# Altium project pca10095.PrjPCB (part 4 of 4)

## Sheet pca10095_sheet6_power_supply.SchDoc: PCA10095 - Power Supply
size A3; Organization: Nordic Semiconductor; DocumentNumber: 6; Revision: 0.8.0; SheetNumber: 6; SheetTotal: 6; Author: GETR; CompanyName: Nordic Semiconductor; DrawnBy: GETR; ProjectName: nRF53 Development Kit
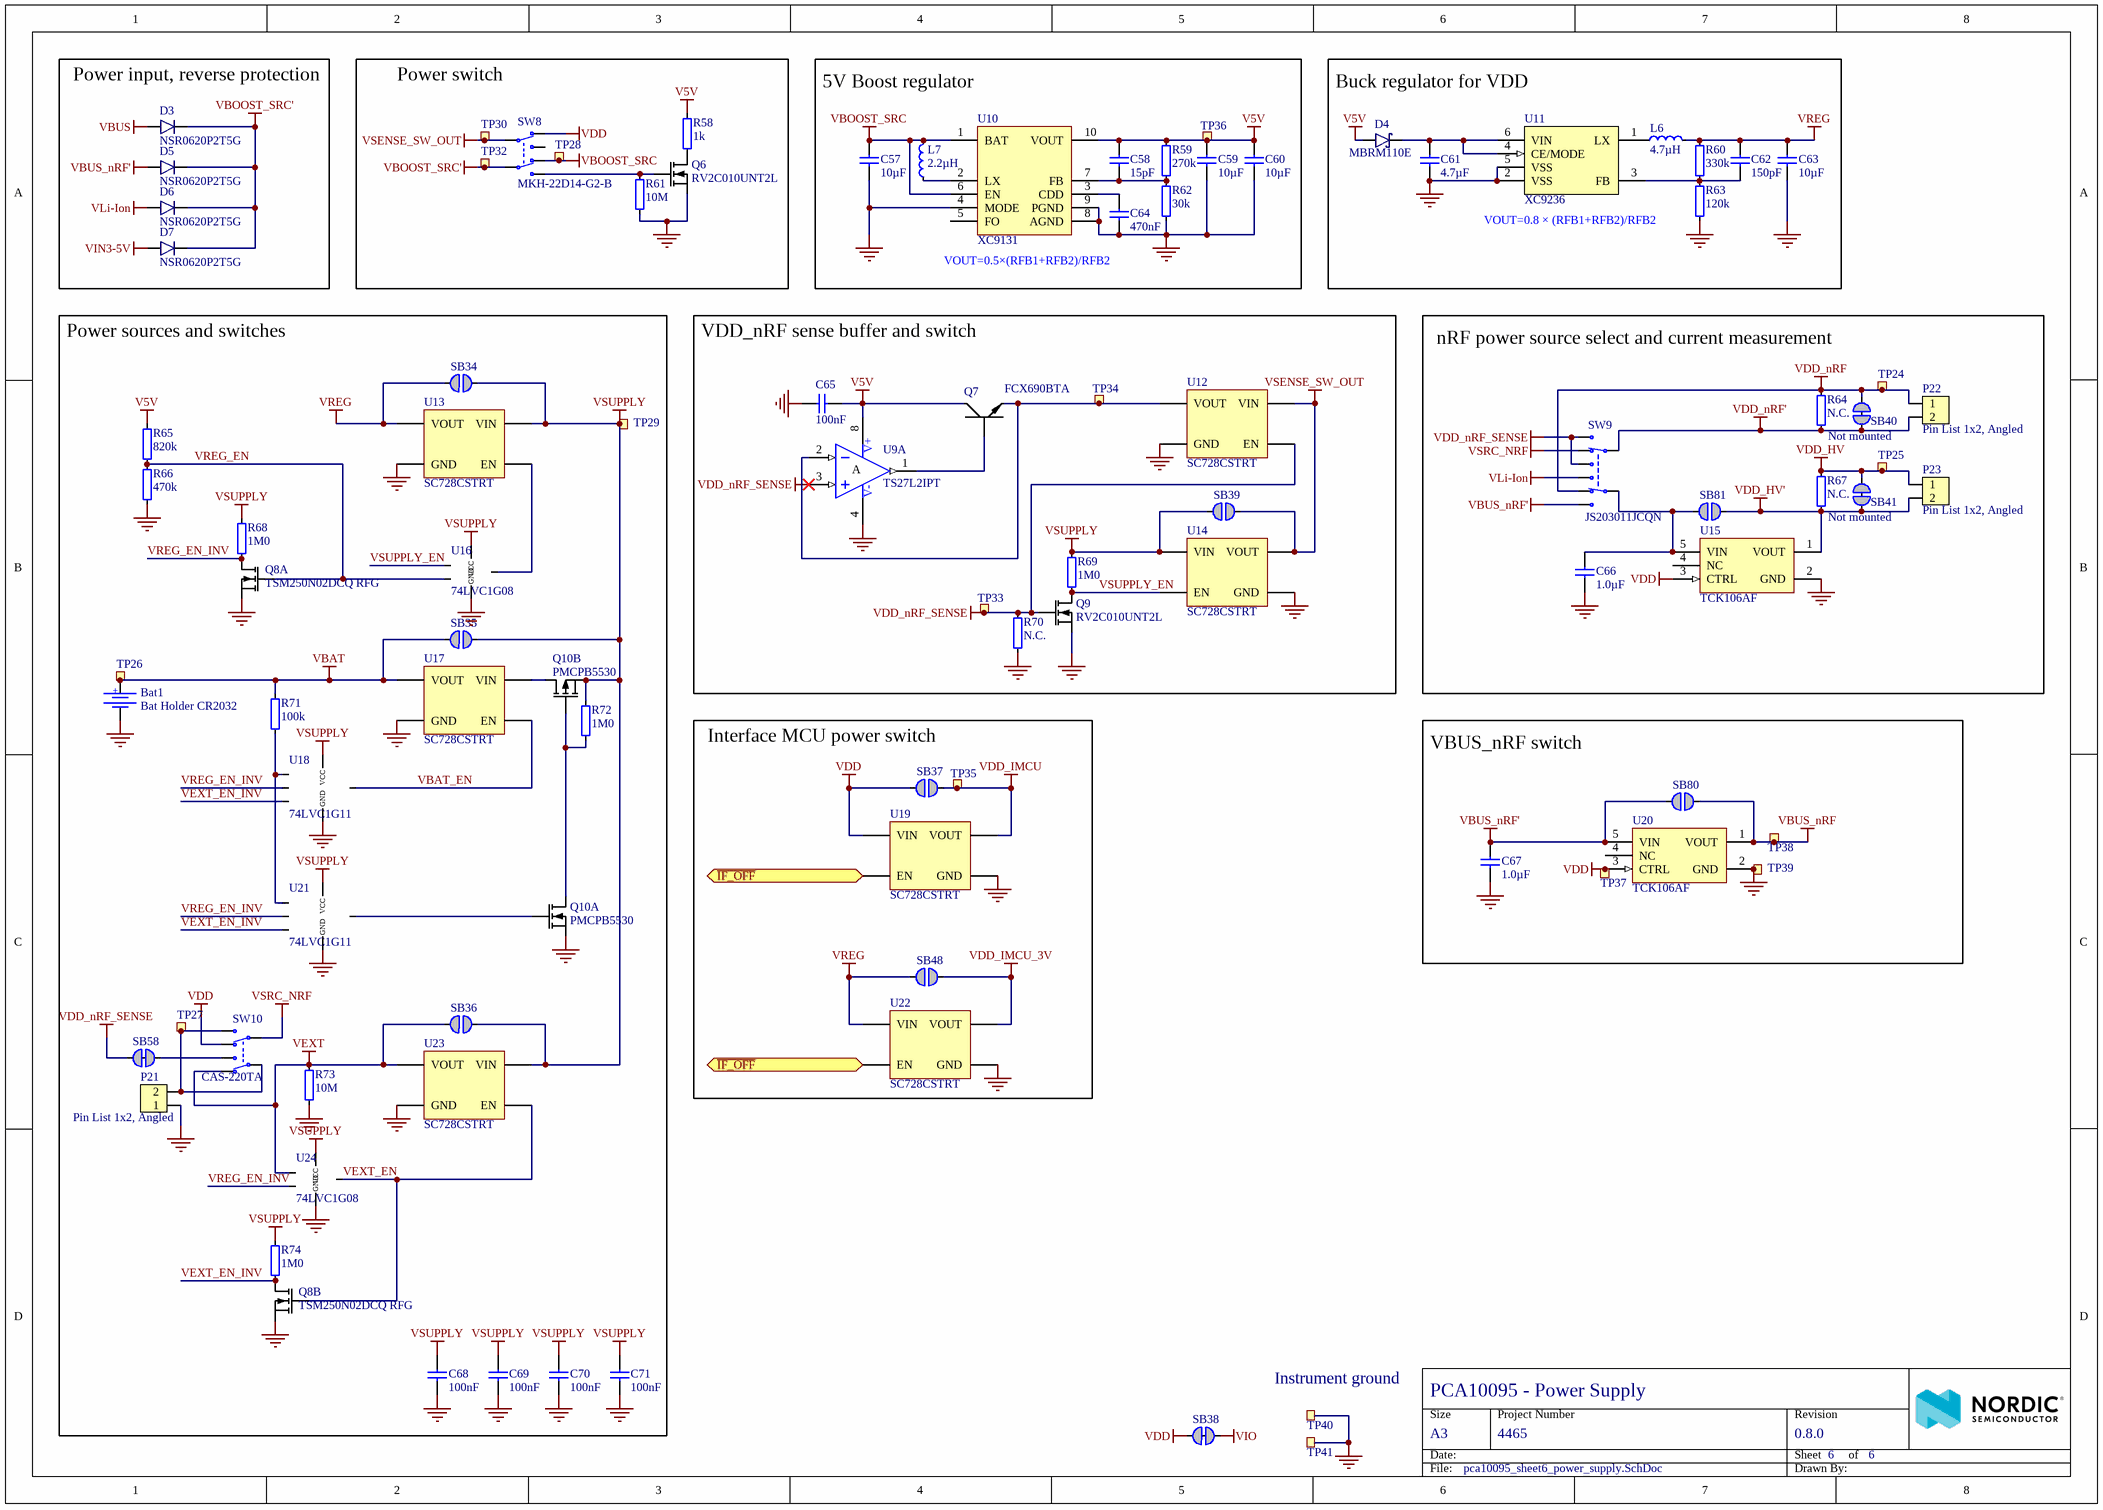
[diagram p5: pca10095_sheet6_power_supply.SchDoc]

### Parts
Bat1  Bat Holder CR2032  [L-KLS5-CR2032-23-B1]
C57  10µF  [CAPC1608X06L]
C58  15pF  [CAPC0603X03L_C]
C59  10µF  [CAPC1608X06L]
C60  10µF  [CAPC1608X06L]
C61  4.7µF  [CAPC1005X04L]
C62  150pF  [CAPC0603X03L_C]
C63  10µF  [CAPC1608X06L]
C64  470nF  [CAPC0603X03L_C]
C65  100nF  [CAPC0603X03L_C]
C66  1.0µF  [CAPC1005X04L]
C67  1.0µF  [CAPC1608X06L]
C68  100nF  [CAPC0603X03L_C]
C69  100nF  [CAPC0603X03L_C]
C70  100nF  [CAPC0603X03L_C]
C71  100nF  [CAPC0603X03L_C]
D3  NSR0620P2T5G  [SODFL100X40-2N]
D4  MBRM110E  [DO-216AA]
D5  NSR0620P2T5G  [SODFL100X40-2N]
D6  NSR0620P2T5G  [SODFL100X40-2N]
D7  NSR0620P2T5G  [SODFL100X40-2N]
L6  4.7µH  [TY-NR3015]
L7  2.2µH  [TY-NR3015]
P21  Pin List 1x2, Angled  [LIST_ANG_1x2-SMD-2.54MM]
P22  Pin List 1x2, Angled  [LIST_ANG_1x2-SMD-2.54MM]
P23  Pin List 1x2, Angled  [LIST_ANG_1x2-SMD-2.54MM]
Q6  RV2C010UNT2L  [DFN65P100X40-3L]
Q7  FCX690BTA  [SOT89-150P409X160-3N]
Q8  TSM250N02DCQ RFG  [DFN65P200X200X80_HS-6N]  (parts A,B of 2)
Q9  RV2C010UNT2L  [DFN65P100X40-3L]
Q10  PMCPB5530  [PMCPB5530X]  (parts A,B of 2)
R58  1k  [RESC0603X03L_C]
R59  270k  [RESC0603X03L_C]
R60  330k  [RESC0603X03L_C]
R61  10M  [RESC0603X03L_C]
R62  30k  [RESC0603X03L_C]
R63  120k  [RESC0603X03L_C]
R64  N.C.  Assembly: Not mounted  [RESC1005X04L]
R65  820k  [RESC0603X03L_C]
R66  470k  [RESC0603X03L_C]
R67  N.C.  Assembly: Not mounted  [RESC1005X04L]
R68  1M0  [RESC0603X03L_C]
R69  1M0  [RESC0603X03L_C]
R70  N.C.  [RESC0603X03L_C]
R71  100k  [RESC0603X03L_C]
R72  1M0  [RESC0603X03L_C]
R73  10M  [RESC0603X03L_C]
R74  1M0  [RESC0603X03L_C]
SB34  Solderbridge  [Solderbridge]  (value not drawn)  (no BOM)
SB35  Solderbridge  [Solderbridge]  (value not drawn)  (no BOM)
SB36  Solderbridge  [Solderbridge]  (value not drawn)  (no BOM)
SB37  Solderbridge  [Solderbridge]  (value not drawn)  (no BOM)
SB38  Solderbridge  [Solderbridge_Shorted]  (value not drawn)  (net tie, no BOM)
SB39  Solderbridge  [Solderbridge]  (value not drawn)  (no BOM)
SB40  Solderbridge  [Solderbridge_Shorted]  (value not drawn)  (net tie, no BOM)
SB41  Solderbridge  [Solderbridge_Shorted]  (value not drawn)  (net tie, no BOM)
SB48  Solderbridge  [Solderbridge]  (value not drawn)  (no BOM)
SB58  Solderbridge  [Solderbridge_Shorted]  (value not drawn)  (net tie, no BOM)
SB80  Solderbridge  [Solderbridge]  (value not drawn)  (no BOM)
SB81  Solderbridge  [Solderbridge]  (value not drawn)  (no BOM)
SW8  MKH-22D14-G2-B  [MKH-22D14-G2-B]
SW9  JS203011JCQN  [Switch-Slide-J-Lead-DP3T-13x3.5mm]
SW10  CAS-220TA  [CAS-220TA]
TP24  Ø1.5mm,SMD  [TP_SMD_Ø1.5mm]  (value not drawn)  (no BOM)
TP25  Ø1.5mm,SMD  [TP_SMD_Ø1.5mm]  (value not drawn)  (no BOM)
TP26  Ø1.5mm,SMD  [TP_SMD_Ø1.5mm]  (value not drawn)  (no BOM)
TP27  Ø1.5mm,SMD  [TP_SMD_Ø1.5mm]  (value not drawn)  (no BOM)
TP28  Ø1.5mm,SMD  [TP_SMD_Ø1.5mm]  (value not drawn)  (no BOM)
TP29  Ø1.0mm,SMD  [TP_SMD_Ø1.0mm]  (value not drawn)  (no BOM)
TP30  Ø1.5mm,SMD  [TP_SMD_Ø1.5mm]  (value not drawn)  (no BOM)
TP32  Ø1.5mm,SMD  [TP_SMD_Ø1.5mm]  (value not drawn)  (no BOM)
TP33  Ø1.0mm,SMD  [TP_SMD_Ø1.0mm]  (value not drawn)  (no BOM)
TP34  Ø1.0mm,SMD  [TP_SMD_Ø1.0mm]  (value not drawn)  (no BOM)
TP35  Ø1.0mm,SMD  [TP_SMD_Ø1.0mm]  (value not drawn)  (no BOM)
TP36  Ø1.0mm,SMD  [TP_SMD_Ø1.0mm]  (value not drawn)  (no BOM)
TP37  Ø1.5mm,SMD  [TP_SMD_Ø1.5mm]  (value not drawn)  (no BOM)
TP38  Ø1.5mm,SMD  [TP_SMD_Ø1.5mm]  (value not drawn)  (no BOM)
TP39  Ø1.5mm,SMD  [TP_SMD_Ø1.5mm]  (value not drawn)  (no BOM)
TP40  TP  [TESTPAD-TH]  (value not drawn)  (no BOM)
TP41  TP  [TESTPAD-TH]  (value not drawn)  (no BOM)
U9  TS27L2IPT  [TSOP65P640X120-8N]  (part A of 2)
U10  XC9131  [10-USPB (2.9x2.6)]
U11  XC9236  [USP-6C]
U12  SC728CSTRT  [BGA4C40P2X2_76X76X62]
U13  SC728CSTRT  [BGA4C40P2X2_76X76X62]
U14  SC728CSTRT  [BGA4C40P2X2_76X76X62]
U15  TCK106AF  [SOT95P280X140-5N]
U16  74LVC1G08  [SOT65P210X100-5N]
U17  SC728CSTRT  [BGA4C40P2X2_76X76X62]
U18  74LVC1G11  [SOT65P210X100-6N]
U19  SC728CSTRT  [BGA4C40P2X2_76X76X62]
U20  TCK106AF  [SOT95P280X140-5N]
U21  74LVC1G11  [SOT65P210X100-6N]
U22  SC728CSTRT  [BGA4C40P2X2_76X76X62]
U23  SC728CSTRT  [BGA4C40P2X2_76X76X62]
U24  74LVC1G08  [SOT65P210X100-5N]

### Blocks framed on the sheet
Power input, reverse protection: D3 D5-D7
Power switch: Q6 R58 R61 SW8 TP28 TP30 TP32
5V Boost regulator: C57-C60 C64 L7 R59 R62 TP36 U10
Buck regulator for VDD: C61-C63 D4 L6 R60 R63 U11
Power sources and switches: Bat1 C68-C71 P21 Q8 Q10 R65 R66 R68 R71-R74 SB34-SB36 SB58 SW10 TP26 TP27 TP29 U13 U16-U18 U21 U23 U24
VDD_nRF sense buffer and switch: C65 Q7 Q9 R69 R70 SB39 TP33 TP34 U9 U12 U14
nRF power source select and current measurement: C66 P22 P23 R64 R67 SB40 SB41 SB81 SW9 TP24 TP25 U15
Interface MCU power switch: SB37 SB48 TP35 U19 U22
VBUS_nRF switch: C67 SB80 TP37-TP39 U20

### Ports
~{IF_OFF} (bidir)

### Nets
GND: Bat1.2 C57.1 C59.1 C60.1 C61.1 C63.1 C64.1 C65.1 C66.1 C67.1 C68.1 C69.1 C70.1 C71.1 P21.1 Q6.2(S) Q8.1(S1) Q8.4(S2) Q9.2(S) Q10.1(S1) R61.2 R62.1 R63.1 R66.2 R70.2 R73.2 TP39.1 TP40.1 TP41.1 U9.4(V-) U10.4(MODE) U10.8(AGND) U10.9(PGND) U10.11(GND) U11.2(VSS) U11.5(VSS) U11.7(VSS) U12.B1(GND) U13.B1(GND) U14.B1(GND) U15.2(GND) U16.3(GND) U17.B1(GND) U18.2(GND) U19.B1(GND) U20.2(GND) U21.2(GND) U22.B1(GND) U23.B1(GND) U24.3(GND)
V5V: C58.2 C59.2 C60.2 C65.2 D4.1(A) Q7.2(C) R58.1 R59.2 R65.1 TP36.1 U9.8(V+) U10.10(VOUT)
VBAT: Bat1.1 R71.1 SB35.2 TP26.1 U17.A1(VOUT)
VBOOST_SRC: C57.2 L7.2 SW8.6(N.C-2) TP28.1 U10.1(BAT) U10.6(EN)
VBOOST_SRC': D3.1(C) D5.1(C) D6.1(C) D7.1(C) SW8.5(COM-2) TP32.1
VBUS: D3.2(A)
VBUS_nRF: SB80.1 TP38.1 U20.1(VOUT)
VBUS_nRF': C67.2 D5.2(A) SB80.2 SW9.8(N.O) U20.5(VIN)
VDD: SB37.2 SB38.2 SW8.3(N.C-1) SW10.6(N.C-2) TP37.1 U15.3(CTRL) U19.A2(VIN) U20.3(CTRL)
VDD_HV: P23.1 R67.2 SB41.1 TP25.1
VDD_HV': P23.2 R67.1 SB41.2 SB81.1 U15.1(VOUT)
VDD_IMCU: SB37.1 TP35.1 U19.A1(VOUT)
VDD_IMCU_3V: SB48.1 U22.A1(VOUT)
VDD_nRF: P22.1 R64.2 SB40.1 SW9.6(N.C) TP24.1
VDD_nRF': P22.2 R64.1 SB40.2 SW9.3(COM)
VDD_nRF_SENSE: Q9.1(G) R70.1 SB58.1 SW9.1(N.O) SW9.4(N.O) TP33.1 U9.3(IN1+) U12.B2(EN)
VEXT: R73.1 SB36.2 SW10.3(N.C-1) U23.A1(VOUT) U24.1(A)
VIN3-5V: D7.2(A)
VIO: SB38.1
VLi-Ion: D6.2(A) SW9.5(N.O)
VREG: C62.2 C63.2 L6.2 R60.2 SB34.2 SB48.2 U13.A1(VOUT) U22.A2(VIN)
VSENSE_SW_OUT: SB39.1 SW8.2(COM-1) TP30.1 U12.A2(VIN) U14.A1(VOUT)
VSRC_NRF: SW9.2(N.C) SW10.5(COM-2)
VSUPPLY: C68.2 C69.2 C70.2 C71.2 Q10.4(S2) R68.1 R69.1 R72.1 R74.1 SB34.1 SB35.1 SB36.1 SB39.2 TP29.1 U13.A2(VIN) U14.A2(VIN) U16.5(VCC) U18.5(VCC) U21.5(VCC) U23.A2(VIN) U24.5(VCC)
~{IF_OFF}: U19.B2(EN) U22.B2(EN) ; port ~{IF_OFF}
VBAT_EN: U17.B2(EN) U18.4(Y)
VEXT_EN: Q8.5(G2) U23.B2(EN) U24.4(Y)
VEXT_EN_INV: Q8.3(D2) R74.2 U18.6(C) U21.6(C)
VREG_EN: Q8.2(G1) R65.2 R66.1 U16.2(B)
VREG_EN_INV: Q8.6(D1) R68.2 U18.3(B) U21.3(B) U24.2(B)
VSUPPLY_EN: Q9.3(D) R69.2 U14.B2(EN) U16.1(A)
NetC58_1: C58.1 R59.1 R62.2 U10.7(FB)
NetC61_2: C61.2 D4.3(C) U11.4(CE/MODE) U11.6(VIN)
NetC62_1: C62.1 R60.1 R63.2 U11.3(FB)
NetC64_2: C64.2 U10.3(CDD)
NetC66_2: C66.2 SB81.2 SW9.7(COM) U15.5(VIN)
NetL6_1: L6.1 U11.1(LX)
NetL7_1: L7.1 U10.2(LX)
NetP21_2: P21.2 SW10.2(COM-1) SW10.4(N.O-2) TP27.1
NetQ6_1: Q6.1(G) R61.1 SW8.4(N.O-2)
NetQ6_3: Q6.3(D) R58.2
NetQ7_1: Q7.1(B) U9.1(OUT1)
NetQ7_3: Q7.3(E) TP34.1 U9.2(IN1-) U12.A1(VOUT)
NetQ10_2: Q10.2(G1) U21.4(Y)
NetQ10_3: Q10.3(D2) U17.A2(VIN)
NetQ10_5: Q10.5(G2) Q10.6(D1) R72.2
NetR71_2: R71.2 U18.1(A) U21.1(A)
NetSB58_2: SB58.2 SW10.1(N.O-1)
NetU13_B2: U13.B2(EN) U16.4(Y)

Not connected (* = marked no-connect by the designer): SW8 1(N.O-1); U10 5(FO); U15 4(NC); U20 4(NC)

### Notes on the sheet
- VOUT=0.8 × (RFB1+RFB2)/RFB2
- VOUT=0.5×(RFB1+RFB2)/RFB2
- (near TP40) Instrument ground
- Size
- Date:
- A3
- Project Number
- Sheet         of
- Revision
- File:
- Drawn By:
- (in symbol Bat Holder Cabcon L-KLS5-CR2032-23-B1) +
- (in symbol TS27L2IPT, part A) A

### Library data of the parts
Bat1 = Bat Holder Cabcon L-KLS5-CR2032-23-B1: Bat Holder CR2032 SMD; Manufacturer: Cabcon; Artikkelnr Noca: N.A.; Part Number: Bat Holder Cabcon L-KLS5-CR2032-23-B1; Manufacturer Part Number: L-KLS5-CR2032-23-B1; ComponentLink1URL: *; ComponentLink1Description: Datasheet; ComponentLink2URL: *; ComponentLink2Description: Supplier link; HelpURL: *; Footprint Doc: CR2032_HOLDER; LatestRevisionDate: 2019-08-28; Pin Count: 2; Publisher: Nordic Semiconductor; Published: 2019-08-28; Value: Bat Holder CR2032; Note: Bat Holder CR2032; Supplier 1: Cabcon; Supplier Part Number 1: L-KLS5-CR2032-23-B1; Supplier 2: Mouser; Supplier Part Number 2: 614-SMTU2032-LF; Part number IPS: N.A.
C57 C59 C60 C63 = C0603-10µF-25V: Capacitor, 0603, 25V, X5R; Part number IPS: N.A.; Artikkelnr Noca: 20039436; Part Number: C0603-10µF-25V; Manufacturer: *; Manufacturer Part Number: *; Footprint Doc: 0603; LatestRevisionDate: 2015-02-25; Pin Count: 2; Publisher: Nordic Semiconductor; Published: 2015-02-25; Value: 10µF; Note: 25V; ComponentLink1URL: *; ComponentLink1Description: Datasheet; ComponentLink2URL: *; ComponentLink2Description: Supplier link; HelpURL: *; Supplier 1: *; Supplier Part Number 1: *; Supplier 2: *; Supplier Part Number 2: *
C58 = C0201-15p: Chip Cap 0201; Note: Chip Cap 1%; Artikkelnr Noca: N.A.; Part Number: C0201-15p; Manufacturer: *; Manufacturer Part Number: *; Footprint Doc: 0201; LatestRevisionDate: 2014-11-13; Pin Count: 2; Publisher: Nordic Semiconductor; Published: 2014-11-13; Value: 15pF; Part number IPS: N.A.; ComponentLink1URL: *; ComponentLink1Description: Datasheet; ComponentLink2URL: *; ComponentLink2Description: Supplier link; HelpURL: *; Supplier 1: *; Supplier Part Number 1: *; Supplier 2: *; Supplier Part Number 2: *
C61 = C0402-4µ7-10V-X5R: CAP CER 4.7UF 10V X5R 0402; Manufacturer: Murata; Manufacturer Part Number: GRM155R61A475MEAAD; Artikkelnr Noca: N.A.; Part Number: C0402-4µ7-10V-X5R; ComponentLink1URL: http://search.murata.co.jp/Ceramy/image/img/A01X/G101/ENG/GRM155R61A475MEAA-01.pdf; ComponentLink1Description: Datasheet; ComponentLink2URL: https://www.digikey.com/product-detail/en/murata-electronics-north-america/GRM155R61A475MEAAD/490-14306-1-ND/6234742; ComponentLink2Description: Supplier link - Digikey; HelpURL: https://psearch.en.murata.com/capacitor/product/GRM155R61A475MEAA%23.html; Footprint Doc: 0402; LatestRevisionDate: 2018-10-04; Pin Count: 2; Publisher: Nordic Semiconductor; Published: 2018-10-04; Value: 4.7µF; Note: 10V; Supplier 1: Digi-Key; Supplier Part Number 1: 490-14306-1-ND; Supplier 2: *; Supplier Part Number 2: *; Part number IPS: N.A.
C62 = C0201-150p: Chip Cap 0201; Note: Chip Cap 1%; Artikkelnr Noca: N.A.; Part Number: C0201-150p; Manufacturer: *; Manufacturer Part Number: *; Footprint Doc: 0201; LatestRevisionDate: 2014-11-13; Pin Count: 2; Publisher: Nordic Semiconductor; Published: 2014-11-13; Value: 150pF; Part number IPS: N.A.; ComponentLink1URL: *; ComponentLink1Description: Datasheet; ComponentLink2URL: *; ComponentLink2Description: Supplier link; HelpURL: *; Supplier 1: *; Supplier Part Number 1: *; Supplier 2: *; Supplier Part Number 2: *
C64 = C0201-470n: Chip Cap 0201; Note: Chip Cap 1%; Artikkelnr Noca: N.A.; Part Number: C0201-470n; Manufacturer: *; Manufacturer Part Number: *; Footprint Doc: 0201; LatestRevisionDate: 2014-11-13; Pin Count: 2; Publisher: Nordic Semiconductor; Published: 2014-11-13; Value: 470nF; Part number IPS: N.A.; ComponentLink1URL: *; ComponentLink1Description: Datasheet; ComponentLink2URL: *; ComponentLink2Description: Supplier link; HelpURL: *; Supplier 1: *; Supplier Part Number 1: *; Supplier 2: *; Supplier Part Number 2: *
C65 C68-C71 = C0201-100n: Capacitor, X5R, ±10%; Part number IPS: 00000001248; Note: 16V; Artikkelnr Noca: N.A.; Part Number: C0201-100n; Manufacturer: *; Manufacturer Part Number: *; Footprint Doc: 0201; LatestRevisionDate: 2017-11-09; Pin Count: 2; Publisher: Nordic Semiconductor; Published: 2014-11-13; Value: 100nF; ComponentLink1URL: *; ComponentLink1Description: Datasheet; ComponentLink2URL: *; ComponentLink2Description: Supplier link; HelpURL: *; Supplier 1: *; Supplier Part Number 1: *; Supplier 2: *; Supplier Part Number 2: *
C66 = C0402-1µ0: Capacitor, X5R, ±5%; Part number IPS: 00000007786; Note: 6.3V; Artikkelnr Noca: 20039235; Part Number: C0402-1µ0; Manufacturer: *; Manufacturer Part Number: *; LatestRevisionDate: 2016-08-22; Pin Count: 2; Publisher: Nordic Semiconductor; Published: 2009-05-08; Value: 1.0µF; Footprint Doc: 0402; ComponentLink1URL: *; ComponentLink1Description: Datasheet; ComponentLink2URL: *; ComponentLink2Description: Supplier link; HelpURL: *; Supplier 1: Digi-Key; Supplier Part Number 1: 1276-1444-1-ND; Supplier 2: *; Supplier Part Number 2: *
C67 = C0603-1µ0: Capacitor, X7R, ±10%; Part number IPS: 00000000616; Note: 16V; Artikkelnr Noca: 20039282; Part Number: C0603-1µ0; Manufacturer: *; Manufacturer Part Number: *; Footprint Doc: 0603; LatestRevisionDate: 2013-06-05; Pin Count: 2; Publisher: Nordic Semiconductor; Published: 2009-05-08; Value: 1.0µF; ComponentLink1URL: *; ComponentLink1Description: Datasheet; ComponentLink2URL: *; ComponentLink2Description: Supplier link; HelpURL: *; Supplier 1: *; Supplier Part Number 1: *; Supplier 2: *; Supplier Part Number 2: *
D3 D5-D7 = NSR0620P2T5G: 20V schottky barrier diode, Vf 350 mV @ 100 mA, Ir 2.0 µA @ 10 V, If 500 mA; Manufacturer: ON Semiconductor; Part number IPS: 00000009952; Artikkelnr Noca: 10029169; Part Number: NSR0620P2T5G; Manufacturer Part Number: NSR0620P2T5G; LatestRevisionDate: 2016-07-07; Publisher: Nordic Semiconductor; Published: 2016-07-07; Value: NSR0620P2T5G; Note: *; Footprint Doc: SOD-923; ComponentLink1URL: *; ComponentLink1Description: Datasheet; ComponentLink2URL: *; ComponentLink2Description: Supplier link; HelpURL: http://www.onsemi.com/pub_link/Collateral/NSR0620P2-D.PDF; Pin Count: 2; Supplier 1: Digi-Key; Supplier Part Number 1: NSR0620P2T5GOSCT-ND; Supplier 2: *; Supplier Part Number 2: *
D4 = MBRM110E: Diode Schottky Vf=0.455V @ 100mA, Vr=10V, If=1000mA, Ir=1µA @ 10V; Manufacturer: ON Semiconductor; Manufacturer Part Number: MBRM110ET1G; Part number IPS: N.A.; Artikkelnr Noca: 10029172; Part Number: MBRM110E; Footprint Doc: DO-216AA; LatestRevisionDate: 2016-10-24; Publisher: Nordic Semiconductor; Published: 2016-10-24; Value: MBRM110E; Note: *; ComponentLink1URL: *; ComponentLink1Description: Datasheet; ComponentLink2URL: *; ComponentLink2Description: Supplier link; HelpURL: http://media.digikey.com/pdf/Data%20Sheets/ON%20Semiconductor%20PDFs/MBRM110E-D.pdf; Pin Count: 2; Supplier 1: Digi-Key; Supplier Part Number 1: MBRM110ET1GOSTR-ND; Supplier 2: Farnell; Supplier Part Number 2: 236-9429
L6 = NR3015-4µ7-1.04A-144mOhm: Ferrite Inductor, Shielded, 1,04A, 144mOhm; Manufacturer: Taiyo Yuden; Manufacturer Part Number: NR3015T4R7M; Part number IPS: 00000009960; Artikkelnr Noca: 33029551; Part Number: NR3015-4µ7-1.04A-144mOhm; Footprint Doc: 1212; LatestRevisionDate: 2014-01-22; Pin Count: 2; Publisher: Nordic Semiconductor; Published: 2014-01-22; Value: 4.7µH; Note: *; ComponentLink1Description: Datasheet; ComponentLink2Description: Supplier link; ComponentLink1URL: *; ComponentLink2URL: *; HelpURL: http://www.yuden.co.jp/ut/product/category/inductor/NR3015T4R7M.pdf; Supplier 1: Digi-Key; Supplier Part Number 1: 587-1649-1-ND; Supplier 2: Mouser; Supplier Part Number 2: 963-NR3015T4R7M
L7 = NR3015-2µ2-1.5A-72mOhm: Ferrite Inductor, Shielded, 1,5A, 72mOhm; Manufacturer: Taiyo Yuden; Manufacturer Part Number: NR3015T2R2M; Part number IPS: N.A.; Artikkelnr Noca: 33029487; Part Number: NR3015-2µ2-1.5A-72mOhm; Footprint Doc: 1212; LatestRevisionDate: 2014-01-22; Pin Count: 2; Publisher: Nordic Semiconductor; Published: 2014-01-22; Value: 2.2µH; Note: *; ComponentLink1Description: Datasheet; ComponentLink2Description: Supplier link; ComponentLink1URL: *; ComponentLink2URL: *; HelpURL: http://www.yuden.co.jp/ut/product/category/inductor/NR3015T2R2M.pdf; Supplier 1: Digi-Key; Supplier Part Number 1: 587-1648-1-ND; Supplier 2: Farnell; Supplier Part Number 2: 188-5853
P21-P23 = Pin List Ang 1x2 SMD, 2.54mm: Pin List 1x2, 2.54mm (100mil), Right Angled, SMD; Manufacturer: W-CON; Manufacturer Part Number: 1125B-1102S0Z135R2; Part number IPS: 00000009972; Artikkelnr Noca: 55010023; Part Number: Pin List Ang 1x2 SMD, 2.54mm; Footprint Doc: LIST_ANG_1x2-SMD-2.54MM; LatestRevisionDate: 2016-05-26; Pin Count: 2; Publisher: Nordic Semiconductor; Published: 2016-01-22; Value: Pin List 1x2, Angled; Note: *; ComponentLink1URL: *; ComponentLink1Description: Datasheet; ComponentLink2URL: *; ComponentLink2Description: Supplier link; HelpURL: \\hizz\pro\app9717\Datasheet\connectores\W-CON\1125B-11XXXXZXXXXX.pdf; Supplier 1: Cabcon; Supplier Part Number 1: 1125B-1102S0Z135R2; Supplier 2: Samtec; Supplier Part Number 2: TSM-102-01-L-SH-A
Q6 Q9 = RV2C010UNT2L: N-Channel MOSFET, 20V, 1A, 470mOhm, 400mW; Manufacturer: Rohm Semiconductor; Part number IPS: 00000009976; Artikkelnr Noca: 35010020; Part Number: RV2C010UNT2L; Manufacturer Part Number: RV2C010UNT2L; Footprint Doc: DFN-3; LatestRevisionDate: 2016-08-09; Publisher: Nordic Semiconductor; Published: 2016-08-09; Value: RV2C010UNT2L; Note: *; ComponentLink1URL: *; ComponentLink1Description: Datasheet; ComponentLink2URL: *; ComponentLink2Description: Supplier link; HelpURL: http://rohmfs.rohm.com/en/products/databook/datasheet/discrete/transistor/mosfet/rv2c010unt2l-e.pdf; Pin Count: 3; Supplier 1: Digi-Key; Supplier Part Number 1: RV2C010UNT2LCT-ND; Supplier 2: Mouser; Supplier Part Number 2: 755-RV2C010UNT2L
Q7 = FCX690BTA: 45V NPN high gain power transistor; Manufacturer: Diodes Incorporated; Part number IPS: 00000009974; Artikkelnr Noca: 35010019; Part Number: FCX690BTA; Manufacturer Part Number: FCX690BTA; Footprint Doc: SOT-89; LatestRevisionDate: 2016-07-07; Publisher: Nordic Semiconductor; Published: 2016-07-07; Value: FCX690BTA; Note: *; ComponentLink1URL: *; ComponentLink1Description: Datasheet; ComponentLink2URL: *; ComponentLink2Description: Supplier link; HelpURL: http://www.diodes.com/_files/datasheets/FCX690B.pdf; Pin Count: 3; Supplier 1: Digi-Key; Supplier Part Number 1: FCX690BCT-ND; Supplier 2: *; Supplier Part Number 2: *
Q8 = TSM250N02DCQ RFG: Dual N Ch MOFET, 5.8A, 55mOhm max, 620mW; Manufacturer: Taiwan Semiconductor; Part number IPS: 00000001703; Artikkelnr Noca: N.A.; Part Number: TSM250N02DCQ RFG; Manufacturer Part Number: TSM250N02DCQ RFG; LatestRevisionDate: 2018-10-31; Pin Count: 6; Publisher: Nordic Semiconductor; Published: 2018-10-31; Value: TSM250N02DCQ RFG; Note: *; Footprint Doc: VDFN-6; ComponentLink1URL: https://www.taiwansemi.com/products/datasheet/TSM250N02D_B15.pdf; ComponentLink1Description: Datasheet; ComponentLink2URL: *; ComponentLink2Description: Supplier link; HelpURL: https://www.taiwansemi.com/products/datasheet/TSM250N02D_B15.pdf; Supplier 1: Digi-Key; Supplier Part Number 1: TSM250N02DCQRFGCT-ND; Supplier 2: *; Supplier Part Number 2: *
Q10 = PMCPB5530X,115: Mosfet Array N and P-Channel 20V 4A (Ta), 3.4A (Ta) 490mW Surface Mount 6-HUSON-EP (2x2); Manufacturer: Nexperia; Artikkelnr Noca: N.A.; Part Number: PMCPB5530X,115; Manufacturer Part Number: PMCPB5530X,115; ComponentLink1URL: https://assets.nexperia.com/documents/data-sheet/PMCPB5530X.pdf; ComponentLink1Description: Datasheet; ComponentLink2URL: https://www.digikey.com/product-detail/en/nexperia-usa-inc/PMCPB5530X115/1727-1327-1-ND/4386339; ComponentLink2Description: Supplier link; HelpURL: https://www.nexperia.com/products/mosfets/small-signal-mosfets/PMCPB5530X.html; Footprint Doc: 6-UDFN; LatestRevisionDate: 2018-04-30; Pin Count: 8; Publisher: Nordic Semiconductor; Published: 2018-04-30; Value: PMCPB5530; Note: *; Supplier 1: Digi-Key; Supplier Part Number 1: 1727-1327-1-ND; Supplier 2: Mouser; Supplier Part Number 2: 771-PMCPB5530X115; Part number IPS: N.A.
R58 = R0201-1k0: Resistor, ±1%, 0.05W; Part number IPS: 00000005786; Note: Chip Res 1%; Artikkelnr Noca: N.A.; Part Number: R0201-1k0; Manufacturer: *; Manufacturer Part Number: *; LatestRevisionDate: 2014-11-13; Pin Count: 2; Publisher: Nordic Semiconductor; Published: 2014-11-13; Value: 1k; Footprint Doc: 0201; ComponentLink1URL: *; ComponentLink1Description: Datasheet; ComponentLink2URL: *; ComponentLink2Description: Supplier link; HelpURL: *; Supplier 1: *; Supplier Part Number 1: *; Supplier 2: *; Supplier Part Number 2: *
R59 = R0201-270k: Resistor, ±1%, 0.05W; Note: Chip Res 1%; Artikkelnr Noca: N.A.; Part Number: R0201-270k; Manufacturer: *; Manufacturer Part Number: *; Footprint Doc: 0201; LatestRevisionDate: 2014-11-13; Pin Count: 2; Publisher: Nordic Semiconductor; Published: 2014-11-13; Value: 270k; Part number IPS: N.A.; ComponentLink1URL: *; ComponentLink1Description: Datasheet; ComponentLink2URL: *; ComponentLink2Description: Supplier link; HelpURL: *; Supplier 1: *; Supplier Part Number 1: *; Supplier 2: *; Supplier Part Number 2: *
R60 = R0201-330k: Resistor, ±1%, 0.05W; Part number IPS: 00000001424; Note: Chip Res 1%; Artikkelnr Noca: N.A.; Part Number: R0201-330k; Manufacturer: *; Manufacturer Part Number: *; Footprint Doc: 0201; LatestRevisionDate: 2014-11-13; Pin Count: 2; Publisher: Nordic Semiconductor; Published: 2014-11-13; Value: 330k; ComponentLink1URL: *; ComponentLink1Description: Datasheet; ComponentLink2URL: *; ComponentLink2Description: Supplier link; HelpURL: *; Supplier 1: *; Supplier Part Number 1: *; Supplier 2: *; Supplier Part Number 2: *
R61 R73 = R0201-10M: Resistor, ±1%, 0.05W; Part number IPS: 00000001426; Note: Chip Res 1%; Artikkelnr Noca: N.A.; Part Number: R0201-10M; Manufacturer: *; Manufacturer Part Number: *; LatestRevisionDate: 2014-11-13; Pin Count: 2; Publisher: Nordic Semiconductor; Published: 2014-11-13; Value: 10M; Footprint Doc: 0201; ComponentLink1URL: *; ComponentLink1Description: Datasheet; ComponentLink2URL: *; ComponentLink2Description: Supplier link; HelpURL: *; Supplier 1: *; Supplier Part Number 1: *; Supplier 2: *; Supplier Part Number 2: *
R62 = R0201-30k: Resistor, ±1%, 0.05W; Note: Chip Res 1%; Artikkelnr Noca: N.A.; Part Number: R0201-30k; Manufacturer: *; Manufacturer Part Number: *; Footprint Doc: 0201; LatestRevisionDate: 2016-04-20; Pin Count: 2; Publisher: Nordic Semiconductor; Published: 2016-04-20; Value: 30k; Part number IPS: N.A.; ComponentLink1URL: *; ComponentLink1Description: Datasheet; ComponentLink2URL: *; ComponentLink2Description: Supplier link; HelpURL: *; Supplier 1: *; Supplier Part Number 1: *; Supplier 2: *; Supplier Part Number 2: *
R63 = R0201-120k: Resistor, ±1%, 0.05W; Part number IPS: 00000001425; Note: Chip Res 1%; Artikkelnr Noca: N.A.; Part Number: R0201-120k; Manufacturer: *; Manufacturer Part Number: *; Footprint Doc: 0201; LatestRevisionDate: 2014-11-13; Pin Count: 2; Publisher: Nordic Semiconductor; Published: 2014-11-13; Value: 120k; ComponentLink1URL: *; ComponentLink1Description: Datasheet; ComponentLink2URL: *; ComponentLink2Description: Supplier link; HelpURL: *; Supplier 1: *; Supplier Part Number 1: *; Supplier 2: *; Supplier Part Number 2: *
R64 R67 = R0402-N.C.: Not mounted; Note: Chip Res; Artikkelnr Noca: N.A.; Part Number: R0402-N.C.; Manufacturer: *; Manufacturer Part Number: *; LatestRevisionDate: 2009-05-08; Pin Count: 2; Publisher: Nordic Semiconductor; Published: 2009-05-08; Value: N.C.; Footprint Doc: 0402; Part number IPS: N.A.; ComponentLink1URL: *; ComponentLink1Description: Datasheet; ComponentLink2URL: *; ComponentLink2Description: Supplier link; HelpURL: *; Supplier 1: *; Supplier Part Number 1: *; Supplier 2: *; Supplier Part Number 2: *
R65 = R0201-820k: Resistor, ±1%, 0.05W; Part number IPS: 00000001427; Note: Chip Res 1%; Artikkelnr Noca: N.A.; Part Number: R0201-820k; Manufacturer: *; Manufacturer Part Number: *; LatestRevisionDate: 2014-11-13; Pin Count: 2; Publisher: Nordic Semiconductor; Published: 2014-11-13; Value: 820k; Footprint Doc: 0201; ComponentLink1URL: *; ComponentLink1Description: Datasheet; ComponentLink2URL: *; ComponentLink2Description: Supplier link; HelpURL: *; Supplier 1: *; Supplier Part Number 1: *; Supplier 2: *; Supplier Part Number 2: *
R66 = R0201-470k: Resistor, ±1%, 0.05W; Part number IPS: 00000001428; Note: Chip Res 1%; Artikkelnr Noca: N.A.; Part Number: R0201-470k; Manufacturer: *; Manufacturer Part Number: *; LatestRevisionDate: 2014-11-13; Pin Count: 2; Publisher: Nordic Semiconductor; Published: 2014-11-13; Value: 470k; Footprint Doc: 0201; ComponentLink1URL: *; ComponentLink1Description: Datasheet; ComponentLink2URL: *; ComponentLink2Description: Supplier link; HelpURL: *; Supplier 1: *; Supplier Part Number 1: *; Supplier 2: *; Supplier Part Number 2: *
R68 R69 R72 R74 = R0201-1M0: Resistor, ±1%, 0.05W; Part number IPS: 00000001418; Note: Chip Res 1%; Artikkelnr Noca: N.A.; Part Number: R0201-1M0; Manufacturer: *; Manufacturer Part Number: *; LatestRevisionDate: 2014-11-13; Pin Count: 2; Publisher: Nordic Semiconductor; Published: 2014-11-13; Value: 1M0; Footprint Doc: 0201; ComponentLink1URL: *; ComponentLink1Description: Datasheet; ComponentLink2URL: *; ComponentLink2Description: Supplier link; HelpURL: *; Supplier 1: *; Supplier Part Number 1: *; Supplier 2: *; Supplier Part Number 2: *
R70 = R0201-N.C.: Not mounted; Note: Chip Res; Artikkelnr Noca: N.A.; Assembly: Not mounted; Part Number: R0201-N.C.; Manufacturer: *; Manufacturer Part Number: *; LatestRevisionDate: 2014-11-13; Pin Count: 2; Publisher: Nordic Semiconductor; Published: 2014-11-13; Value: N.C.; Footprint Doc: 0201; Part number IPS: N.A.; ComponentLink1URL: *; ComponentLink1Description: Datasheet; ComponentLink2URL: *; ComponentLink2Description: Supplier link; HelpURL: *; Supplier 1: *; Supplier Part Number 1: *; Supplier 2: *; Supplier Part Number 2: *
R71 = R0201-100k: Resistor, ±1%, 0.05W; Part number IPS: 00000001419; Note: Chip Res 1%; Artikkelnr Noca: N.A.; Part Number: R0201-100k; Manufacturer: *; Manufacturer Part Number: *; LatestRevisionDate: 2014-11-13; Pin Count: 2; Publisher: Nordic Semiconductor; Published: 2014-11-13; Value: 100k; Footprint Doc: 0201; ComponentLink1URL: *; ComponentLink1Description: Datasheet; ComponentLink2URL: *; ComponentLink2Description: Supplier link; HelpURL: *; Supplier 1: *; Supplier Part Number 1: *; Supplier 2: *; Supplier Part Number 2: *
SB34-SB37 SB39 SB48 SB80 SB81 = Solderbridge: Artikkelnr Noca: N.A.; Part Number: Solderbridge; Manufacturer: *; Manufacturer Part Number: *; LatestRevisionDate: 2009-12-14; Pin Count: 2; Publisher: Nordic Semiconductor; Published: 2009-12-14; Value: Solderbridge; Note: *; Footprint Doc: Solderbridge; Part number IPS: N.A.; ComponentLink1URL: *; ComponentLink1Description: Datasheet; ComponentLink2URL: *; ComponentLink2Description: Supplier link; HelpURL: *; Supplier 1: *; Supplier Part Number 1: *; Supplier 2: *; Supplier Part Number 2: *
SB38 SB40 SB41 SB58 = Solderbridge Shorted: Shorted Solderbridge; Artikkelnr Noca: N.A.; Part Number: Solderbridge Shorted; Manufacturer: *; Manufacturer Part Number: *; LatestRevisionDate: 2012-08-07; Pin Count: 2; Publisher: Nordic Semiconductor; Published: 2012-08-07; Value: Solderbridge; Note: *; Footprint Doc: Solderbridge_Shorted; Part number IPS: N.A.; ComponentLink1URL: *; ComponentLink1Description: Datasheet; ComponentLink2URL: *; ComponentLink2Description: Supplier link; HelpURL: *; Supplier 1: *; Supplier Part Number 1: *; Supplier 2: *; Supplier Part Number 2: *
SW8 = MKH-22D14-G2-B: Slide Switch DPDT; Manufacturer: Dailywell; Part number IPS: N.A.; Artikkelnr Noca: 50019112; Part Number: MKH-22D14-G2-B; Manufacturer Part Number: MKH-22D14-G2-B; Footprint Doc: MKH-22D14-G2-B; LatestRevisionDate: 2016-08-18; Pin Count: 6; Publisher: Nordic Semiconductor; Published: 2016-08-18; Value: MKH-22D14-G2-B; Note: *; ComponentLink1URL: *; ComponentLink1Description: Datasheet; ComponentLink2URL: *; ComponentLink2Description: Supplier link; HelpURL: \\hizz\pro\app9717\Datasheet\switches\Dailywell\MKH-22D14-G2-B.pdf; Supplier 1: *; Supplier Part Number 1: *; Supplier 2: *; Supplier Part Number 2: *
SW9 = JS203011JCQN: Slide Switch DP3T 300mA 6V; Manufacturer: C&K Components; Part number IPS: N.A.; Artikkelnr Noca: 50019116; Part Number: JS203011JCQN; Manufacturer Part Number: JS203011JCQN; Footprint Doc: Switch-Slide-J-Lead-DP3T-13x3.5mm; LatestRevisionDate: 2016-10-05; Pin Count: 8; Publisher: Nordic Semiconductor; Published: 2016-10-05; Value: JS203011JCQN; Note: *; ComponentLink1URL: *; ComponentLink1Description: Datasheet; ComponentLink2URL: *; ComponentLink2Description: Supplier link; HelpURL: http://www.ckswitches.com/media/1422/js.pdf; Supplier 1: Digi-Key; Supplier Part Number 1: CKN10725CT-ND; Supplier 2: *; Supplier Part Number 2: *
SW10 = CAS-220TA: Slide Switch DPDT J Hook; Manufacturer: Copal Electronics Inc; Part number IPS: 00000009983; Artikkelnr Noca: 50019042; Part Number: CAS-220TA; Manufacturer Part Number: CAS-220TA; Footprint Doc: CAS-220TA; LatestRevisionDate: 2010-02-18; Pin Count: 6; Publisher: Nordic Semiconductor; Published: 2010-02-18; Value: CAS-220TA; Note: *; ComponentLink1URL: *; ComponentLink1Description: Datasheet; ComponentLink2URL: *; ComponentLink2Description: Supplier link; HelpURL: http://media.digikey.com/pdf/Data%20Sheets/COPAL%20Electronics%20PDFs/CAS%20SMD%20Slide%20Switch.pdf; Supplier 1: Digi-Key; Supplier Part Number 1: CAS220JTR-ND; Supplier 2: *; Supplier Part Number 2: *
TP24-TP28 TP30 TP32 TP37-TP39 = TP_SMD_Ø1.5MM: 1.0mm circular SMD testpad; Manufacturer: Nordic Semiconductor; Artikkelnr Noca: N.A.; Part Number: TP_SMD_Ø1.5MM; Manufacturer Part Number: *; LatestRevisionDate: 2016-06-02; Pin Count: 1; Publisher: Nordic Semiconductor; Published: 2016-06-02; Value: Ø1.5mm,SMD; Note: *; Footprint Doc: TP_SMD_Ø1.5mm; Part number IPS: N.A.; ComponentLink1URL: *; ComponentLink1Description: Datasheet; ComponentLink2URL: *; ComponentLink2Description: Supplier link; HelpURL: *; Supplier 1: *; Supplier Part Number 1: *; Supplier 2: *; Supplier Part Number 2: *
TP29 TP33-TP36 = TP_SMD_Ø1.0MM: 1.0mm circular SMD testpad; Manufacturer: Nordic Semiconductor; Artikkelnr Noca: N.A.; Part Number: TP_SMD_Ø1.0MM; Manufacturer Part Number: *; LatestRevisionDate: 2013-06-11; Pin Count: 1; Publisher: Nordic Semiconductor; Published: 2013-06-11; Value: Ø1.0mm,SMD; Note: *; Footprint Doc: TP_SMD_Ø1.0mm; Part number IPS: N.A.; ComponentLink1URL: *; ComponentLink1Description: Datasheet; ComponentLink2URL: *; ComponentLink2Description: Supplier link; HelpURL: *; Supplier 1: *; Supplier Part Number 1: *; Supplier 2: *; Supplier Part Number 2: *
TP40 TP41 = Testpoint TH: Testpoint, through hole; Artikkelnr Noca: N.A.; Part Number: Testpoint TH; Manufacturer: *; Manufacturer Part Number: *; Footprint Doc: TESTPAD-TH; LatestRevisionDate: 2009-12-12; Pin Count: 1; Publisher: Nordic Semiconductor; Published: 2009-12-12; Value: TP; Note: *; Part number IPS: N.A.; ComponentLink1URL: *; ComponentLink1Description: Datasheet; ComponentLink2URL: *; ComponentLink2Description: Supplier link; HelpURL: *; Supplier 1: *; Supplier Part Number 1: *; Supplier 2: *; Supplier Part Number 2: *
U9 = TS27L2IPT: Precision very low power CMOS dual operational amplifier; Manufacturer: STMicroelectronics; Part number IPS: 00000009991; Artikkelnr Noca: 17010019; Part Number: TS27L2IPT; Manufacturer Part Number: TS27L2IPT; Footprint Doc: TSSOP-8; LatestRevisionDate: 2016-07-07; Pin Count: 8; Publisher: Nordic Semiconductor; Published: 2016-07-07; Value: TS27L2IPT; Note: *; ComponentLink1URL: *; ComponentLink1Description: Datasheet; ComponentLink2URL: *; ComponentLink2Description: Supplier link; HelpURL: http://www.st.com/content/ccc/resource/technical/document/datasheet/38/5b/ca/bd/c0/26/4a/34/CD00000880.pdf/files/CD00000880.pdf/jcr:content/translations/en.CD00000880.pdf; Supplier 1: Digi-Key; Supplier Part Number 1: 497-8085-1-ND; Supplier 2: *; Supplier Part Number 2: *
U10 = XC9131H05CDR-G: 1A Driver Transistor Built-In, Multi Functional Step-Up DC/DC Converter; Manufacturer: Torex Semiconductor; Part number IPS: N.A.; Artikkelnr Noca: 17030086; Part Number: XC9131H05CDR-G; Manufacturer Part Number: XC9131H05CDR-G; Footprint Doc: UFDFN-10; LatestRevisionDate: 2016-08-08; Pin Count: 10; Publisher: Nordic Semiconductor; Published: 2016-08-08; Value: XC9131; Note: *; ComponentLink1URL: *; ComponentLink1Description: Datasheet; ComponentLink2URL: *; ComponentLink2Description: Supplier link; HelpURL: http://www.torexsemi.com/products/dcdc_converters/data/XC9131.pdf; Supplier 1: Digi-Key; Supplier Part Number 1: XC9131H05CDR-G-ND; Supplier 2: *; Supplier Part Number 2: *
U11 = XC9236D08CER-G: 600mA Driver Transistor Built-In, Synchronous Step-Down DC/DC Converters; Manufacturer: Torex Semiconductor; Part number IPS: N.A.; Artikkelnr Noca: 17030085; Part Number: XC9236D08CER-G; Manufacturer Part Number: XC9236D08CER-G; Footprint Doc: USP-6C; LatestRevisionDate: 2017-11-15; Pin Count: 6; Publisher: Nordic Semiconductor; Published: 2017-11-15; Value: XC9236; Note: *; ComponentLink1URL: *; ComponentLink1Description: Datasheet; ComponentLink2URL: *; ComponentLink2Description: Supplier link; HelpURL: http://www.torexsemi.com/products/dcdc_converters/data/XC9235~37.pdf; Supplier 1: Mouser; Supplier Part Number 1: 865-XC9236D08CER-G; Supplier 2: Digi-Key; Supplier Part Number 2: XC9236D08CER-G-ND
U12-U14 U17 U19 U22 U23 = SC728CSTRT: Semtech, 2A Low Vin, Very Low Ron, Load Switch, 4DSBGA; Manufacturer: Semtech Corporation; Part number IPS: N.A.; Artikkelnr Noca: 15070081; Part Number: SC728CSTRT; Manufacturer Part Number: SC728CSTRT; Footprint Doc: WCSP-4; LatestRevisionDate: 2015-01-01; Pin Count: 4; Publisher: Nordic Semiconductor; Published: 2016-06-16; Value: SC728CSTRT; Note: *; ComponentLink1URL: *; ComponentLink1Description: Datasheet; ComponentLink2URL: *; ComponentLink2Description: Supplier link; HelpURL: http://www.semtech.com/images/datasheet/sc728.pdf; Supplier 1: Digi-Key; Supplier Part Number 1: SC728CSTRTCT-ND; Supplier 2: Mouser; Supplier Part Number 2: 947-SC728CSTRT
U15 U20 = TCK106AF,LF: 1.0 A Load Switch IC with Slew Rate Control Driver in Small Package; Manufacturer: Toshiba; Part number IPS: 00000007823; Artikkelnr Noca: 15070086; Part Number: TCK106AF,LF; Manufacturer Part Number: TCK106AF,LF; Footprint Doc: SOT-25; LatestRevisionDate: 2016-09-29; Pin Count: 5; Publisher: Nordic Semiconductor; Published: 2016-09-29; Value: TCK106AF; Note: *; ComponentLink1URL: *; ComponentLink1Description: Datasheet; ComponentLink2URL: *; ComponentLink2Description: Supplier link; HelpURL: https://toshiba.semicon-storage.com/info/docget.jsp?did=53240&prodName=TCK108AF; Supplier 1: Digi-Key; Supplier Part Number 1: TCK106AFLFCT-ND; Supplier 2: *; Supplier Part Number 2: *
U16 U24 = 74LVC1G08GW: Single 2-Input AND Gate; Manufacturer: NXP Semiconductors; Part number IPS: 00000009992; Artikkelnr Noca: 15049058; Part Number: 74LVC1G08GW; Manufacturer Part Number: 74LVC1G08GW; Footprint Doc: SC70-5; LatestRevisionDate: 2016-10-18; Pin Count: 5; Publisher: Nordic Semiconductor; Published: 2016-10-18; Value: 74LVC1G08; Note: Single 2-Input AND Gate; ComponentLink1URL: *; ComponentLink1Description: Datasheet; ComponentLink2URL: *; ComponentLink2Description: Supplier link; HelpURL: http://www.nxp.com/documents/data_sheet/74LVC1G08.pdf; Supplier 1: Digi-Key; Supplier Part Number 1: 568-1580-1-ND; Supplier 2: Farnell; Supplier Part Number 2: 242-8299
U18 U21 = 74LVC1G11GW: Single 3-input AND gate; Manufacturer: NXP Semiconductors; Part number IPS: 00000001430; Artikkelnr Noca: 15079348; Part Number: 74LVC1G11GW; Manufacturer Part Number: 74LVC1G11GW; Footprint Doc: SC70-6; LatestRevisionDate: 2016-10-18; Pin Count: 6; Publisher: Nordic Semiconductor; Published: 2016-10-18; Value: 74LVC1G11; Note: Single 3-input AND gate; ComponentLink1URL: *; ComponentLink1Description: Datasheet; ComponentLink2URL: *; ComponentLink2Description: Supplier link; HelpURL: http://www.nxp.com/documents/data_sheet/74LVC1G11.pdf; Supplier 1: Digi-Key; Supplier Part Number 1: 568-7757-1-ND; Supplier 2: Farnell; Supplier Part Number 2: 243-8826

## Nets that join several sheets
GND: pca10095_sheet2_nrf5340_mcu (40 pins), pca10095_sheet3_interface_mcu (36 pins), pca10095_sheet4_misc (22 pins), pca10095_sheet5_connectors (84 pins), pca10095_sheet6_power_supply (50 pins)
V5V: pca10095_sheet5_connectors (5 pins), pca10095_sheet6_power_supply (12 pins)
VBUS: pca10095_sheet2_nrf5340_mcu (R1.1), pca10095_sheet4_misc (Q5.2 R52.1), pca10095_sheet5_connectors (C50.2 FB2.2), pca10095_sheet6_power_supply (D3.2)
VBUS_nRF': pca10095_sheet5_connectors (C48.2 FB1.2), pca10095_sheet6_power_supply (5 pins)
VDD: pca10095_sheet4_misc (16 pins), pca10095_sheet5_connectors (R57.2 SB47.1 SB59.2), pca10095_sheet6_power_supply (8 pins)
VDD_HV: pca10095_sheet2_nrf5340_mcu (C26.1 U1.E1), pca10095_sheet5_connectors (P20.10 P26.10), pca10095_sheet6_power_supply (P23.1 R67.2 SB41.1 TP25.1)
VDD_HV': pca10095_sheet5_connectors (P20.11 P26.11), pca10095_sheet6_power_supply (5 pins)
VDD_IMCU: pca10095_sheet3_interface_mcu (31 pins), pca10095_sheet6_power_supply (SB37.1 TP35.1 U19.A1)
VDD_IMCU_3V: pca10095_sheet3_interface_mcu (R11.2 SB19.2), pca10095_sheet6_power_supply (SB48.1 U22.A1)
VDD_nRF: pca10095_sheet2_nrf5340_mcu (33 pins), pca10095_sheet4_misc (SB18.1), pca10095_sheet5_connectors (P20.1 P26.1), pca10095_sheet6_power_supply (5 pins)
VDD_nRF': pca10095_sheet5_connectors (P20.2 P26.2 SB60.2), pca10095_sheet6_power_supply (P22.2 R64.1 SB40.2 SW9.3)
VIN3-5V: pca10095_sheet5_connectors (P20.9 P26.9), pca10095_sheet6_power_supply (D7.2)
VIO: pca10095_sheet5_connectors (9 pins), pca10095_sheet6_power_supply (SB38.1)
VLi-Ion: pca10095_sheet5_connectors (J6.2 P27.2 TP31.1), pca10095_sheet6_power_supply (D6.2 SW9.5)
D_N: pca10095_sheet2_nrf5340_mcu (U1.B4), pca10095_sheet5_connectors (R53.1)
D_P: pca10095_sheet2_nrf5340_mcu (U1.B2), pca10095_sheet5_connectors (R54.1)
DHSD_N: pca10095_sheet3_interface_mcu (R16.1), pca10095_sheet5_connectors (D2.2 J2.2 TP10.1)
DHSD_P: pca10095_sheet3_interface_mcu (R15.1), pca10095_sheet5_connectors (D2.3 J2.3 TP9.1)
EXT_VTG: pca10095_sheet3_interface_mcu (Q2.4 R8.1), pca10095_sheet5_connectors (P19.1 SB47.2)
~{IF_OFF}: pca10095_sheet3_interface_mcu (Q1.2 Q2.2), pca10095_sheet4_misc (6 pins), pca10095_sheet6_power_supply (U19.B2 U22.B2)
IMCU_BOOT: pca10095_sheet3_interface_mcu (U2.53), pca10095_sheet4_misc (SB46.2 U6.15)
MX25_~{CS}: pca10095_sheet2_nrf5340_mcu (SB13.2), pca10095_sheet4_misc (U7.1)
MX25_SCLK: pca10095_sheet2_nrf5340_mcu (SB11.2), pca10095_sheet4_misc (U7.6)
MX25_SIO0: pca10095_sheet2_nrf5340_mcu (SB12.2), pca10095_sheet4_misc (U7.5)
MX25_SIO1: pca10095_sheet2_nrf5340_mcu (SB14.2), pca10095_sheet4_misc (U7.2)
MX25_SIO2: pca10095_sheet2_nrf5340_mcu (SB15.2), pca10095_sheet4_misc (U7.3)
MX25_SIO3: pca10095_sheet2_nrf5340_mcu (SB10.2), pca10095_sheet4_misc (U7.7)
NetP1_3: pca10095_sheet4_misc (SB43.2 SB44.1 U6.4), pca10095_sheet5_connectors (5 pins)
NetP6_3: pca10095_sheet2_nrf5340_mcu (R42.1), pca10095_sheet5_connectors (P6.3 P12.3 P17.6)
NetP6_4: pca10095_sheet2_nrf5340_mcu (R45.1), pca10095_sheet5_connectors (P6.4 P12.4 P17.8)
NetP24_3: pca10095_sheet2_nrf5340_mcu (SB22.2), pca10095_sheet5_connectors (P24.3)
NetP24_4: pca10095_sheet2_nrf5340_mcu (SB24.2), pca10095_sheet5_connectors (P24.4)
NetP24_5: pca10095_sheet2_nrf5340_mcu (SB25.2), pca10095_sheet5_connectors (P24.5)
NetP24_6: pca10095_sheet2_nrf5340_mcu (SB20.2), pca10095_sheet5_connectors (P24.6)
NetP24_7: pca10095_sheet2_nrf5340_mcu (SB21.2), pca10095_sheet5_connectors (P24.7)
NetP24_8: pca10095_sheet2_nrf5340_mcu (SB23.2), pca10095_sheet5_connectors (P24.8)
NetR57_1: pca10095_sheet4_misc (U6.10), pca10095_sheet5_connectors (R57.1 SB33.2 TP19.1)
NFC1: pca10095_sheet4_misc (C43.1 R43.1), pca10095_sheet5_connectors (J5.2 TP17.1)
NFC2: pca10095_sheet4_misc (C44.2 R46.1), pca10095_sheet5_connectors (J5.4 TP18.1)
P0.00: pca10095_sheet2_nrf5340_mcu (SB3.2), pca10095_sheet5_connectors (P6.1 P12.1 P17.2)
P0.01: pca10095_sheet2_nrf5340_mcu (SB4.2), pca10095_sheet5_connectors (P6.2 P12.2 P17.4)
P0.02/NFC1: pca10095_sheet2_nrf5340_mcu (R42.2 U1.W1), pca10095_sheet4_misc (R43.2)
P0.03/NFC2: pca10095_sheet2_nrf5340_mcu (R45.2 U1.AA1), pca10095_sheet4_misc (R46.2)
P0.04/AIN0: pca10095_sheet2_nrf5340_mcu (U1.V2), pca10095_sheet5_connectors (P2.1 P8.1 P14.2 TP42.1)
P0.05/AIN1: pca10095_sheet2_nrf5340_mcu (U1.Y2), pca10095_sheet5_connectors (P2.2 P8.2 P14.4 TP43.1)
P0.06/AIN2: pca10095_sheet2_nrf5340_mcu (U1.AB2), pca10095_sheet5_connectors (P2.3 P8.3 P14.6 TP44.1)
P0.07/AIN3: pca10095_sheet2_nrf5340_mcu (U1.AD2), pca10095_sheet5_connectors (7 pins)
P0.08/TRACEDATA3: pca10095_sheet2_nrf5340_mcu (U1.AH2), pca10095_sheet4_misc (SW3.2), pca10095_sheet5_connectors (P6.6 P12.6 P17.12 P25.20)
P0.09/TRACEDATA2: pca10095_sheet2_nrf5340_mcu (U1.AJ1), pca10095_sheet4_misc (SW4.2), pca10095_sheet5_connectors (P6.7 P12.7 P17.14 P25.18)
P0.10/TRACEDATA1: pca10095_sheet2_nrf5340_mcu (U1.AK2), pca10095_sheet5_connectors (P6.8 P12.8 P17.16 P25.16)
P0.11/TRACEDATA0: pca10095_sheet2_nrf5340_mcu (U1.AK4), pca10095_sheet4_misc (SB57.1), pca10095_sheet5_connectors (P18.6 P24.1 P25.6 P25.14)
P0.12/TRACECLK: pca10095_sheet2_nrf5340_mcu (U1.AK6), pca10095_sheet5_connectors (P24.2 P25.12)
P0.19: pca10095_sheet2_nrf5340_mcu (U1.AL13), pca10095_sheet4_misc (SB51.1), pca10095_sheet5_connectors (P24.9)
P0.20: pca10095_sheet2_nrf5340_mcu (U1.AK16), pca10095_sheet4_misc (SB53.1), pca10095_sheet5_connectors (P24.10)
P0.21: pca10095_sheet2_nrf5340_mcu (U1.AL15), pca10095_sheet4_misc (SB50.1), pca10095_sheet5_connectors (P24.11)
P0.22: pca10095_sheet2_nrf5340_mcu (U1.AK18), pca10095_sheet4_misc (SB52.1), pca10095_sheet5_connectors (P24.12)
P0.23: pca10095_sheet2_nrf5340_mcu (U1.AK20), pca10095_sheet4_misc (SW1.2), pca10095_sheet5_connectors (P24.13)
P0.24: pca10095_sheet2_nrf5340_mcu (U1.AL27), pca10095_sheet4_misc (SW2.2), pca10095_sheet5_connectors (P24.14)
P0.25/AIN4: pca10095_sheet2_nrf5340_mcu (U1.AK28), pca10095_sheet5_connectors (P2.5 P8.5 P14.10 TP46.1)
P0.26/AIN5: pca10095_sheet2_nrf5340_mcu (U1.AL29), pca10095_sheet5_connectors (P2.6 P8.6 P14.12 TP47.1)
P0.27/AIN6: pca10095_sheet2_nrf5340_mcu (U1.AK30), pca10095_sheet5_connectors (P4.8 P10.8 P16.16)
P0.28/AIN7: pca10095_sheet2_nrf5340_mcu (U1.AE31), pca10095_sheet4_misc (SB5.1), pca10095_sheet5_connectors (P24.15)
P0.29: pca10095_sheet2_nrf5340_mcu (U1.U31), pca10095_sheet4_misc (SB6.1), pca10095_sheet5_connectors (P24.16)
P0.30: pca10095_sheet2_nrf5340_mcu (U1.B24), pca10095_sheet4_misc (SB7.1), pca10095_sheet5_connectors (P24.17)
P0.31: pca10095_sheet2_nrf5340_mcu (U1.B22), pca10095_sheet4_misc (SB8.1), pca10095_sheet5_connectors (P24.18)
P1.00: pca10095_sheet2_nrf5340_mcu (U1.M2), pca10095_sheet5_connectors (P3.1 P9.1 P15.2)
P1.01: pca10095_sheet2_nrf5340_mcu (U1.P2), pca10095_sheet5_connectors (P3.2 P9.2 P15.4)
P1.02: pca10095_sheet2_nrf5340_mcu (R20.1), pca10095_sheet4_misc (U6.8), pca10095_sheet5_connectors (P4.9 P10.9 P16.18)
P1.03: pca10095_sheet2_nrf5340_mcu (R24.1), pca10095_sheet4_misc (U6.12), pca10095_sheet5_connectors (P4.10 P10.10 P16.20)
P1.04: pca10095_sheet2_nrf5340_mcu (U1.AL19), pca10095_sheet5_connectors (P3.3 P9.3 P15.6)
P1.05: pca10095_sheet2_nrf5340_mcu (U1.AK22), pca10095_sheet5_connectors (P3.4 P9.4 P15.8)
P1.06: pca10095_sheet2_nrf5340_mcu (U1.AL21), pca10095_sheet5_connectors (P3.5 P9.5 P15.10)
P1.07: pca10095_sheet2_nrf5340_mcu (U1.AK24), pca10095_sheet5_connectors (P3.6 P9.6 P15.12)
P1.08: pca10095_sheet2_nrf5340_mcu (U1.AL23), pca10095_sheet5_connectors (P3.7 P9.7 P15.14)
P1.09: pca10095_sheet2_nrf5340_mcu (U1.AK26), pca10095_sheet5_connectors (P3.8 P9.8 P15.16)
P1.10: pca10095_sheet2_nrf5340_mcu (U1.R31), pca10095_sheet5_connectors (P4.1 P10.1 P16.2)
P1.11: pca10095_sheet2_nrf5340_mcu (U1.B20), pca10095_sheet5_connectors (P4.2 P10.2 P16.4)
P1.12: pca10095_sheet2_nrf5340_mcu (U1.B18), pca10095_sheet5_connectors (P4.3 P10.3 P16.6)
P1.13: pca10095_sheet2_nrf5340_mcu (U1.A17), pca10095_sheet5_connectors (5 pins)
P1.14: pca10095_sheet2_nrf5340_mcu (U1.B16), pca10095_sheet5_connectors (5 pins)
P1.15: pca10095_sheet2_nrf5340_mcu (U1.B14), pca10095_sheet5_connectors (5 pins)
~{RESET}: pca10095_sheet2_nrf5340_mcu (U1.AC31), pca10095_sheet4_misc (SB42.2 SB44.2 SB45.2 SB56.1), pca10095_sheet5_connectors (P18.10 P25.10)
SH_VTG: pca10095_sheet3_interface_mcu (Q1.4 R26.1), pca10095_sheet5_connectors (P20.3 P26.3)
SWD0_RESET: pca10095_sheet3_interface_mcu (R18.2), pca10095_sheet5_connectors (P19.10)
SWD0_SWDCLK: pca10095_sheet3_interface_mcu (R22.2), pca10095_sheet5_connectors (P19.4)
SWD0_SWDIO: pca10095_sheet3_interface_mcu (R27.2), pca10095_sheet5_connectors (P19.2)
SWD0_SWO: pca10095_sheet3_interface_mcu (U8.7), pca10095_sheet5_connectors (P19.6)
SWD1_RESET: pca10095_sheet3_interface_mcu (R19.2), pca10095_sheet5_connectors (P20.7 P26.7)
SWD1_SWDCLK: pca10095_sheet3_interface_mcu (R23.2), pca10095_sheet5_connectors (P20.5 P26.5)
SWD1_SWDIO: pca10095_sheet3_interface_mcu (R28.2), pca10095_sheet5_connectors (P20.4 P26.4)
SWD1_SWO: pca10095_sheet3_interface_mcu (U8.3), pca10095_sheet5_connectors (P20.6 P26.6)
SWD3_RESET: pca10095_sheet3_interface_mcu (R21.2), pca10095_sheet4_misc (TP7.1 U5.7)
SWD3_SWDCLK: pca10095_sheet3_interface_mcu (R25.2), pca10095_sheet4_misc (TP6.1 U5.3)
SWD3_SWDIO: pca10095_sheet3_interface_mcu (R76.2), pca10095_sheet4_misc (TP5.1 U5.15)
SWD3_SWO: pca10095_sheet3_interface_mcu (U8.1), pca10095_sheet4_misc (TP8.1 U5.11)
SWDCLK: pca10095_sheet2_nrf5340_mcu (U1.W31), pca10095_sheet4_misc (SB55.1), pca10095_sheet5_connectors (P18.4 P25.4)
SWDIO: pca10095_sheet2_nrf5340_mcu (U1.AA31), pca10095_sheet4_misc (SB54.1), pca10095_sheet5_connectors (P18.2 P25.2)
VCOM1_CTS: pca10095_sheet3_interface_mcu (R36.1 U2.98), pca10095_sheet5_connectors (P24.19)
VCOM1_RTS: pca10095_sheet3_interface_mcu (R35.2), pca10095_sheet5_connectors (P24.21)
VCOM1_RxD: pca10095_sheet3_interface_mcu (R37.1 U2.99), pca10095_sheet5_connectors (P24.22)
VCOM1_TxD: pca10095_sheet3_interface_mcu (R38.2 R39.1), pca10095_sheet5_connectors (P24.20)
VCOM2_CTS: pca10095_sheet3_interface_mcu (R13.1 U2.57), pca10095_sheet4_misc (TP1.1 U3.3)
VCOM2_RTS: pca10095_sheet3_interface_mcu (R17.2), pca10095_sheet4_misc (TP3.1 U3.15)
VCOM2_RxD: pca10095_sheet3_interface_mcu (R40.1 U2.58), pca10095_sheet4_misc (TP2.1 U3.11)
VCOM2_TxD: pca10095_sheet3_interface_mcu (R14.2 R41.1), pca10095_sheet4_misc (TP4.1 U3.7)